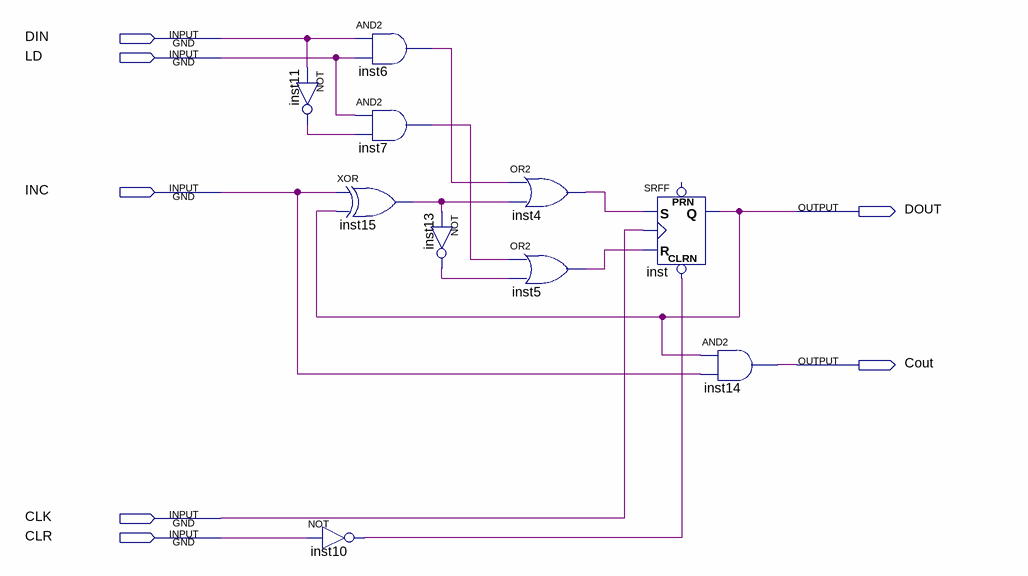
[diagram p0: schematic sheet]
// Quartus schematic reg1_ld_clr_inc.bdf as structural Verilog: 10 symbols, 7 pins
module reg1_ld_clr_inc (
  input  DIN,
  input  LD,
  input  INC,
  input  CLK,
  input  CLR,
  output DOUT,
  output Cout
);

  wire inst4_out, inst5_out, inst6_out, inst7_out, inst10_out, inst11_out, inst13_out, inst15_out;

  not inst11 (inst11_out, DIN);
  not inst10 (inst10_out, CLR);
  and inst6 (inst6_out, DIN, LD);
  and inst7 (inst7_out, LD, inst11_out);
  xor inst15 (inst15_out, INC, DOUT);
  not inst13 (inst13_out, inst15_out);
  or inst4 (inst4_out, inst6_out, inst15_out);
  or inst5 (inst5_out, inst7_out, inst13_out);
  SRFF inst (.CLRN(inst10_out), .S(inst4_out), .R(inst5_out), .CLK(CLK), .Q(DOUT));  // open: PRN
  and inst14 (Cout, DOUT, INC);
endmodule
